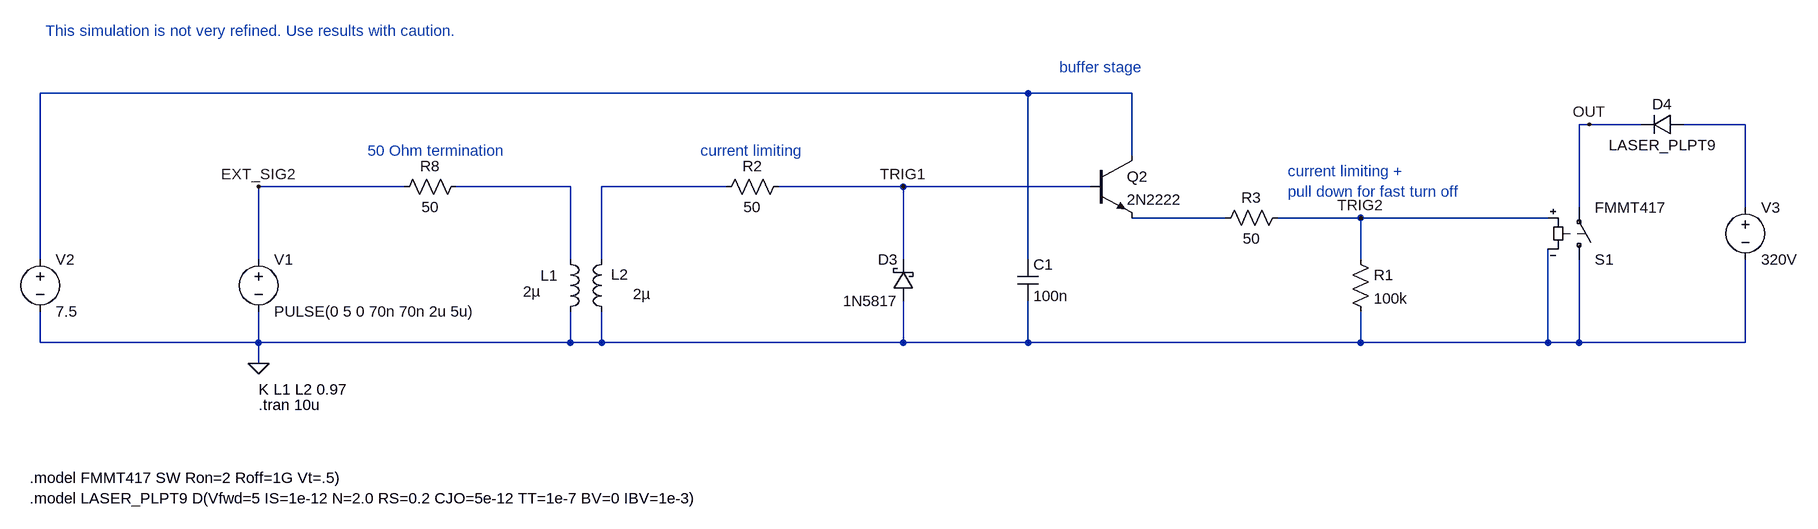
[diagram p0: schematic isolated_tigger_input.asc]
isolated_tigger_input.asc, the LTspice schematic file:
Version 4.1
SHEET 1 3416 888
WIRE 2224 224 704 224
WIRE 2384 224 2224 224
WIRE 3088 272 3072 272
WIRE 3168 272 3088 272
WIRE 3328 272 3232 272
WIRE 2384 320 2384 224
WIRE 1264 368 1040 368
WIRE 1520 368 1344 368
WIRE 1760 368 1568 368
WIRE 2032 368 1840 368
WIRE 2320 368 2032 368
WIRE 3072 400 3072 272
WIRE 3328 400 3328 272
WIRE 2528 416 2384 416
WIRE 2736 416 2608 416
WIRE 3024 416 2736 416
WIRE 704 480 704 224
WIRE 1040 480 1040 368
WIRE 1520 480 1520 368
WIRE 1568 480 1568 368
WIRE 2032 480 2032 368
WIRE 2224 480 2224 224
WIRE 2736 480 2736 416
WIRE 704 608 704 560
WIRE 1040 608 1040 560
WIRE 1040 608 704 608
WIRE 1520 608 1520 560
WIRE 1520 608 1040 608
WIRE 1568 608 1568 560
WIRE 1568 608 1520 608
WIRE 2032 608 2032 544
WIRE 2032 608 1568 608
WIRE 2224 608 2224 544
WIRE 2224 608 2032 608
WIRE 2736 608 2736 560
WIRE 2736 608 2224 608
WIRE 3024 608 3024 464
WIRE 3024 608 2736 608
WIRE 3072 608 3072 480
WIRE 3072 608 3024 608
WIRE 3328 608 3328 480
WIRE 3328 608 3072 608
WIRE 1040 640 1040 608
FLAG 1040 640 0
FLAG 2032 368 TRIG1
FLAG 1040 368 EXT_SIG2
FLAG 2736 416 TRIG2
FLAG 3088 272 OUT
SYMBOL res 1856 352 R90
WINDOW 0 0 56 VBottom 2
WINDOW 3 32 56 VTop 2
SYMATTR InstName R2
SYMATTR Value 50
SYMBOL voltage 3328 384 R0
WINDOW 123 0 0 Left 0
WINDOW 39 0 0 Left 0
SYMATTR InstName V3
SYMATTR Value 320V
SYMBOL ind 1504 464 R0
WINDOW 0 -30 41 Left 2
WINDOW 3 -57 65 Left 2
SYMATTR InstName L1
SYMATTR Value 2µ
SYMATTR Type ind
SYMATTR SpiceLine Rser=0.7 Cpar=2p
SYMBOL ind 1584 464 M0
WINDOW 0 -25 39 Left 2
WINDOW 3 -59 69 Left 2
SYMATTR InstName L2
SYMATTR Value 2µ
SYMATTR Type ind
SYMATTR SpiceLine Rser=0.7 Cpar=2p
SYMBOL res 1360 352 R90
WINDOW 0 0 56 VBottom 2
WINDOW 3 32 56 VTop 2
SYMATTR InstName R8
SYMATTR Value 50
SYMBOL schottky 2048 544 R180
WINDOW 0 24 64 Left 2
WINDOW 3 24 0 Left 2
SYMATTR InstName D3
SYMATTR Value 1N5817
SYMBOL diode 3232 256 R90
WINDOW 0 0 32 VBottom 2
WINDOW 3 32 32 VTop 2
SYMATTR InstName D4
SYMATTR Value LASER_PLPT9
SYMBOL res 2720 464 R0
SYMATTR InstName R1
SYMATTR Value 100k
SYMBOL voltage 1040 464 R0
WINDOW 123 0 0 Left 0
WINDOW 39 0 0 Left 0
SYMATTR InstName V1
SYMATTR Value PULSE(0 5 0 70n 70n 2u 5u)
SYMBOL npn 2320 320 R0
SYMATTR InstName Q2
SYMATTR Value 2N2222
SYMBOL voltage 704 464 R0
WINDOW 123 0 0 Left 0
WINDOW 39 0 0 Left 0
SYMATTR InstName V2
SYMATTR Value 7.5
SYMBOL cap 2208 480 R0
SYMATTR InstName C1
SYMATTR Value 100n
SYMBOL res 2624 400 R90
WINDOW 0 0 56 VBottom 2
WINDOW 3 32 56 VTop 2
SYMATTR InstName R3
SYMATTR Value 50
SYMBOL sw 3072 496 M180
SYMATTR InstName S1
SYMATTR Value FMMT417
TEXT 1040 680 Left 2 !K L1 L2 0.97
TEXT 1040 704 Left 2 !.tran 10u
TEXT 1208 312 Left 2 ;50 Ohm termination
TEXT 1720 312 Left 2 ;current limiting
TEXT 2272 184 Left 2 ;buffer stage
TEXT 2624 344 Left 2 ;current limiting +\npull down for fast turn off
TEXT 688 816 Left 2 !.model FMMT417 SW Ron=2 Roff=1G Vt=.5)
TEXT 688 848 Left 2 !.model LASER_PLPT9 D(Vfwd=5 IS=1e-12 N=2.0 RS=0.2 CJO=5e-12 TT=1e-7 BV=0 IBV=1e-3)
TEXT 712 128 Left 2 ;This simulation is not very refined. Use results with caution.

The netlist it stands for:
* isolated_tigger_input.asc
R2 TRIG1 N004 50
V3 N002 0 320V
L1 N003 0 2µ Rser=0.7 Cpar=2p
L2 N004 0 2µ Rser=0.7 Cpar=2p
R8 N003 EXT_SIG2 50
D3 0 TRIG1 1N5817
D4 N002 OUT LASER_PLPT9
R1 TRIG2 0 100k
V1 EXT_SIG2 0 PULSE(0 5 0 70n 70n 2u 5u)
Q2 N001 TRIG1 N005 0 2N2222
V2 N001 0 7.5
C1 N001 0 100n
R3 TRIG2 N005 50
S1 0 OUT TRIG2 0 FMMT417
.model D D
.lib standard.dio
.model NPN NPN
.model PNP PNP
.lib standard.bjt
K L1 L2 0.97
.tran 10u
* 50 Ohm termination
* current limiting
* buffer stage
* current limiting +
* pull down for fast turn off
.model FMMT417 SW Ron=2 Roff=1G Vt=.5)
.model LASER_PLPT9 D(Vfwd=5 IS=1e-12 N=2.0 RS=0.2 CJO=5e-12 TT=1e-7 BV=0 IBV=1e-3)
* This simulation is not very refined. Use results with caution.
.backanno
.end